# EAGLE schematic MM2_plates (EAGLE 7.4.0)
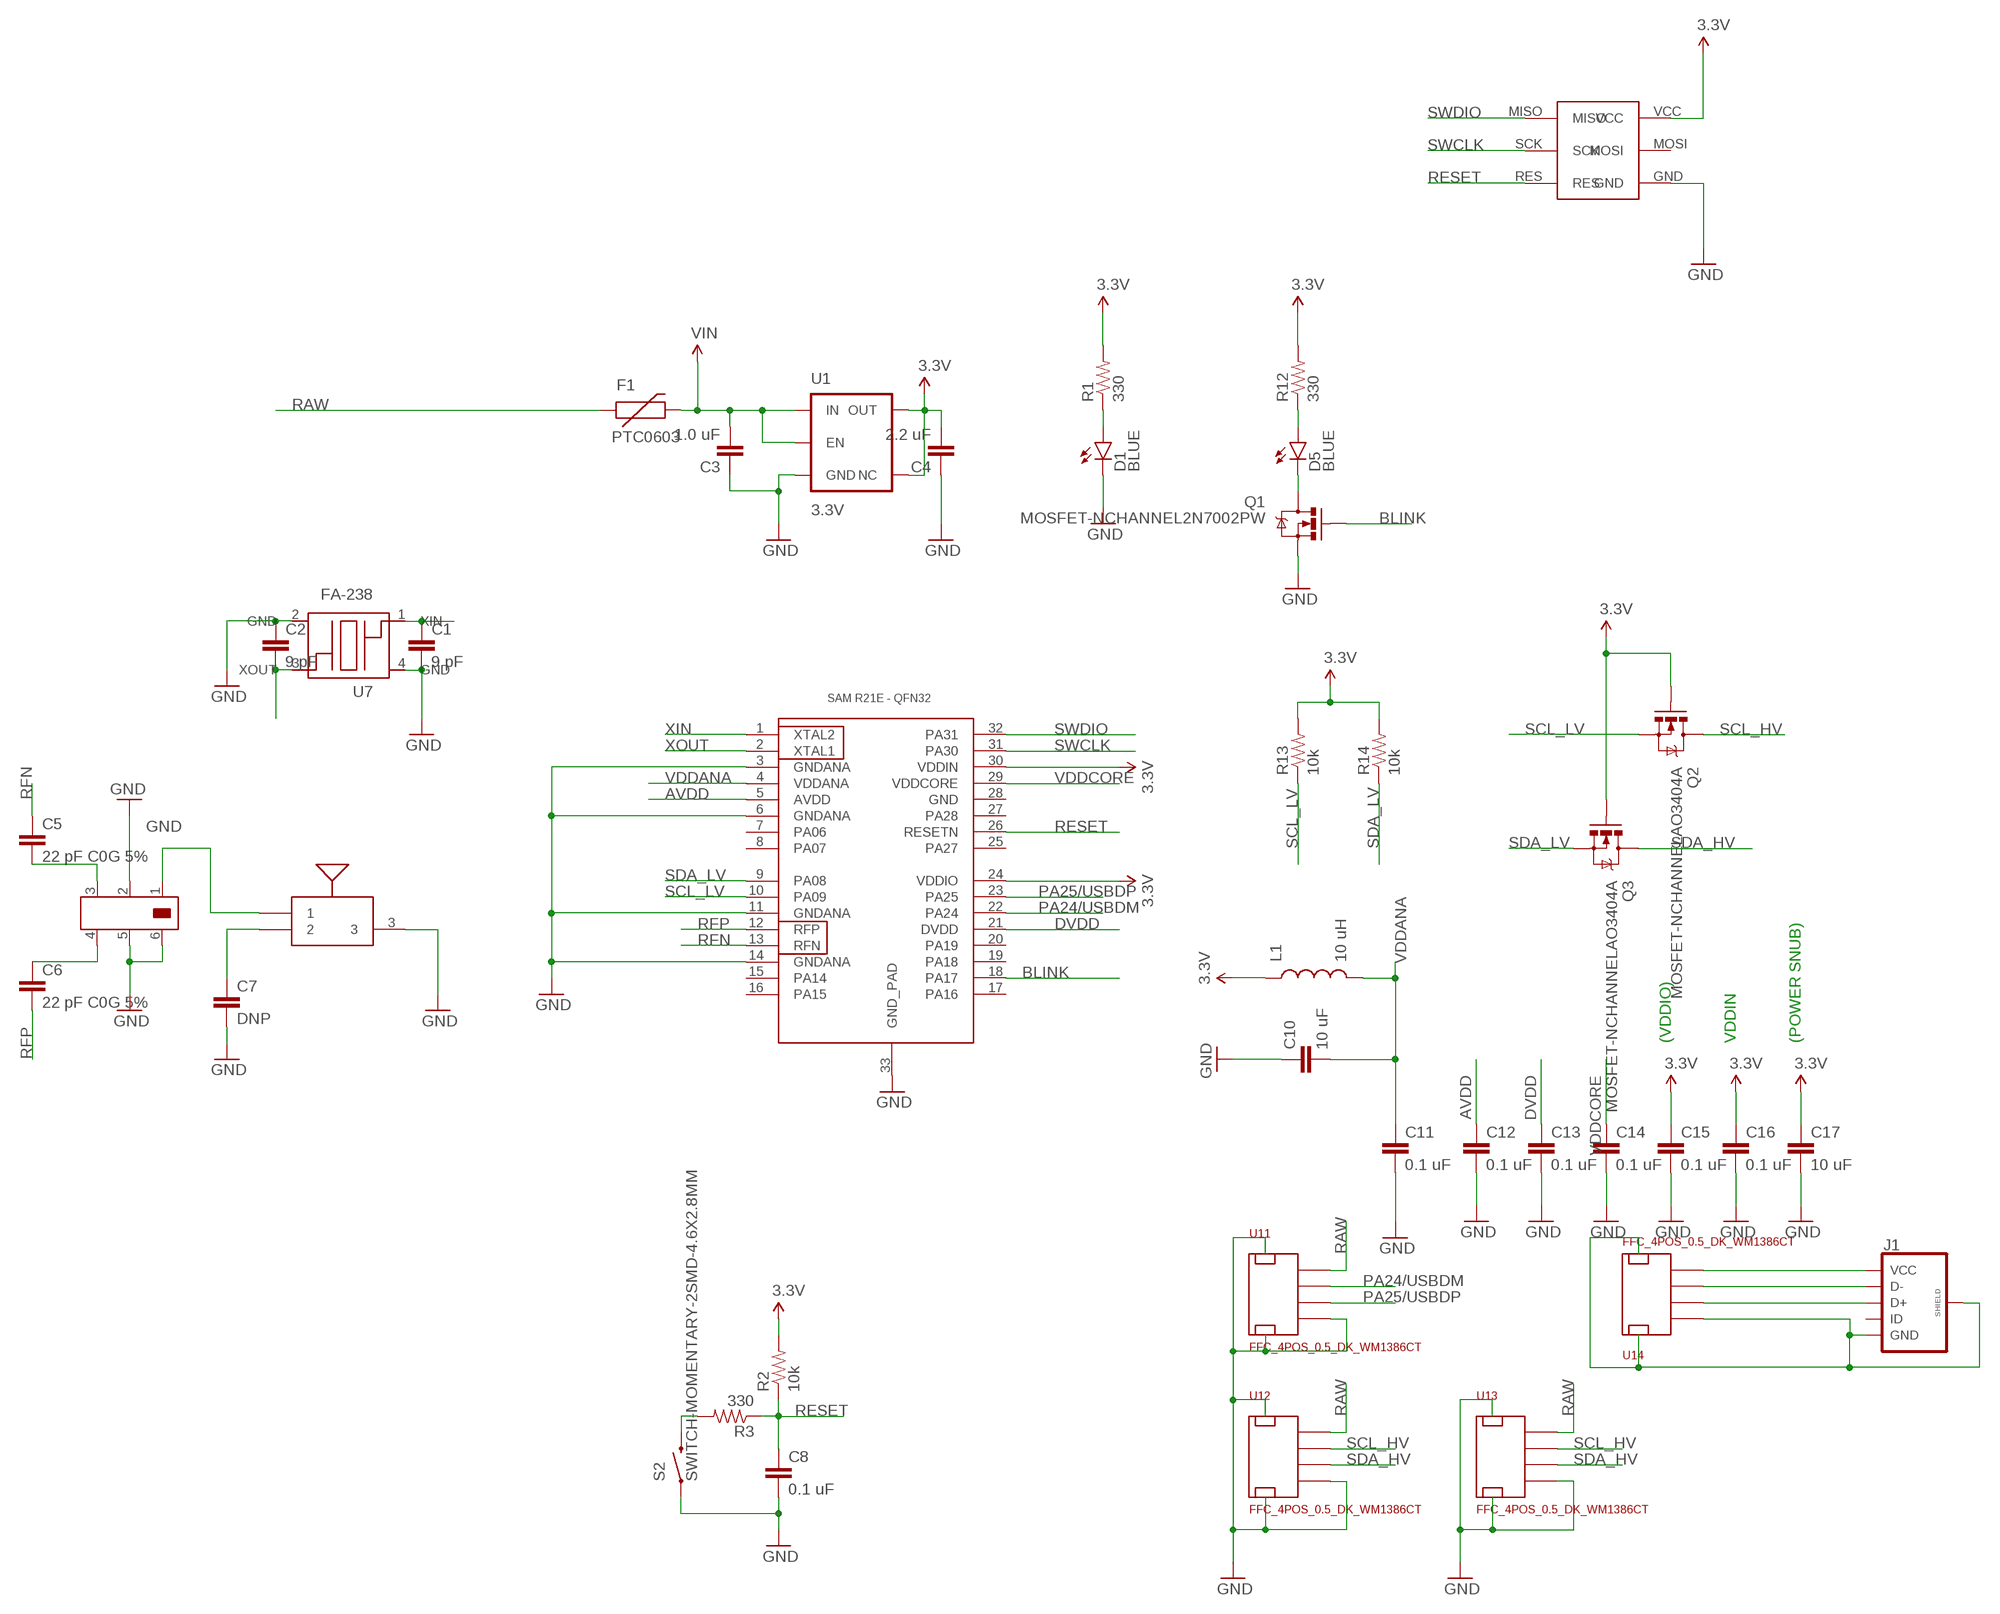
[diagram p0: schematic, sheet 1, part 1 of 2]
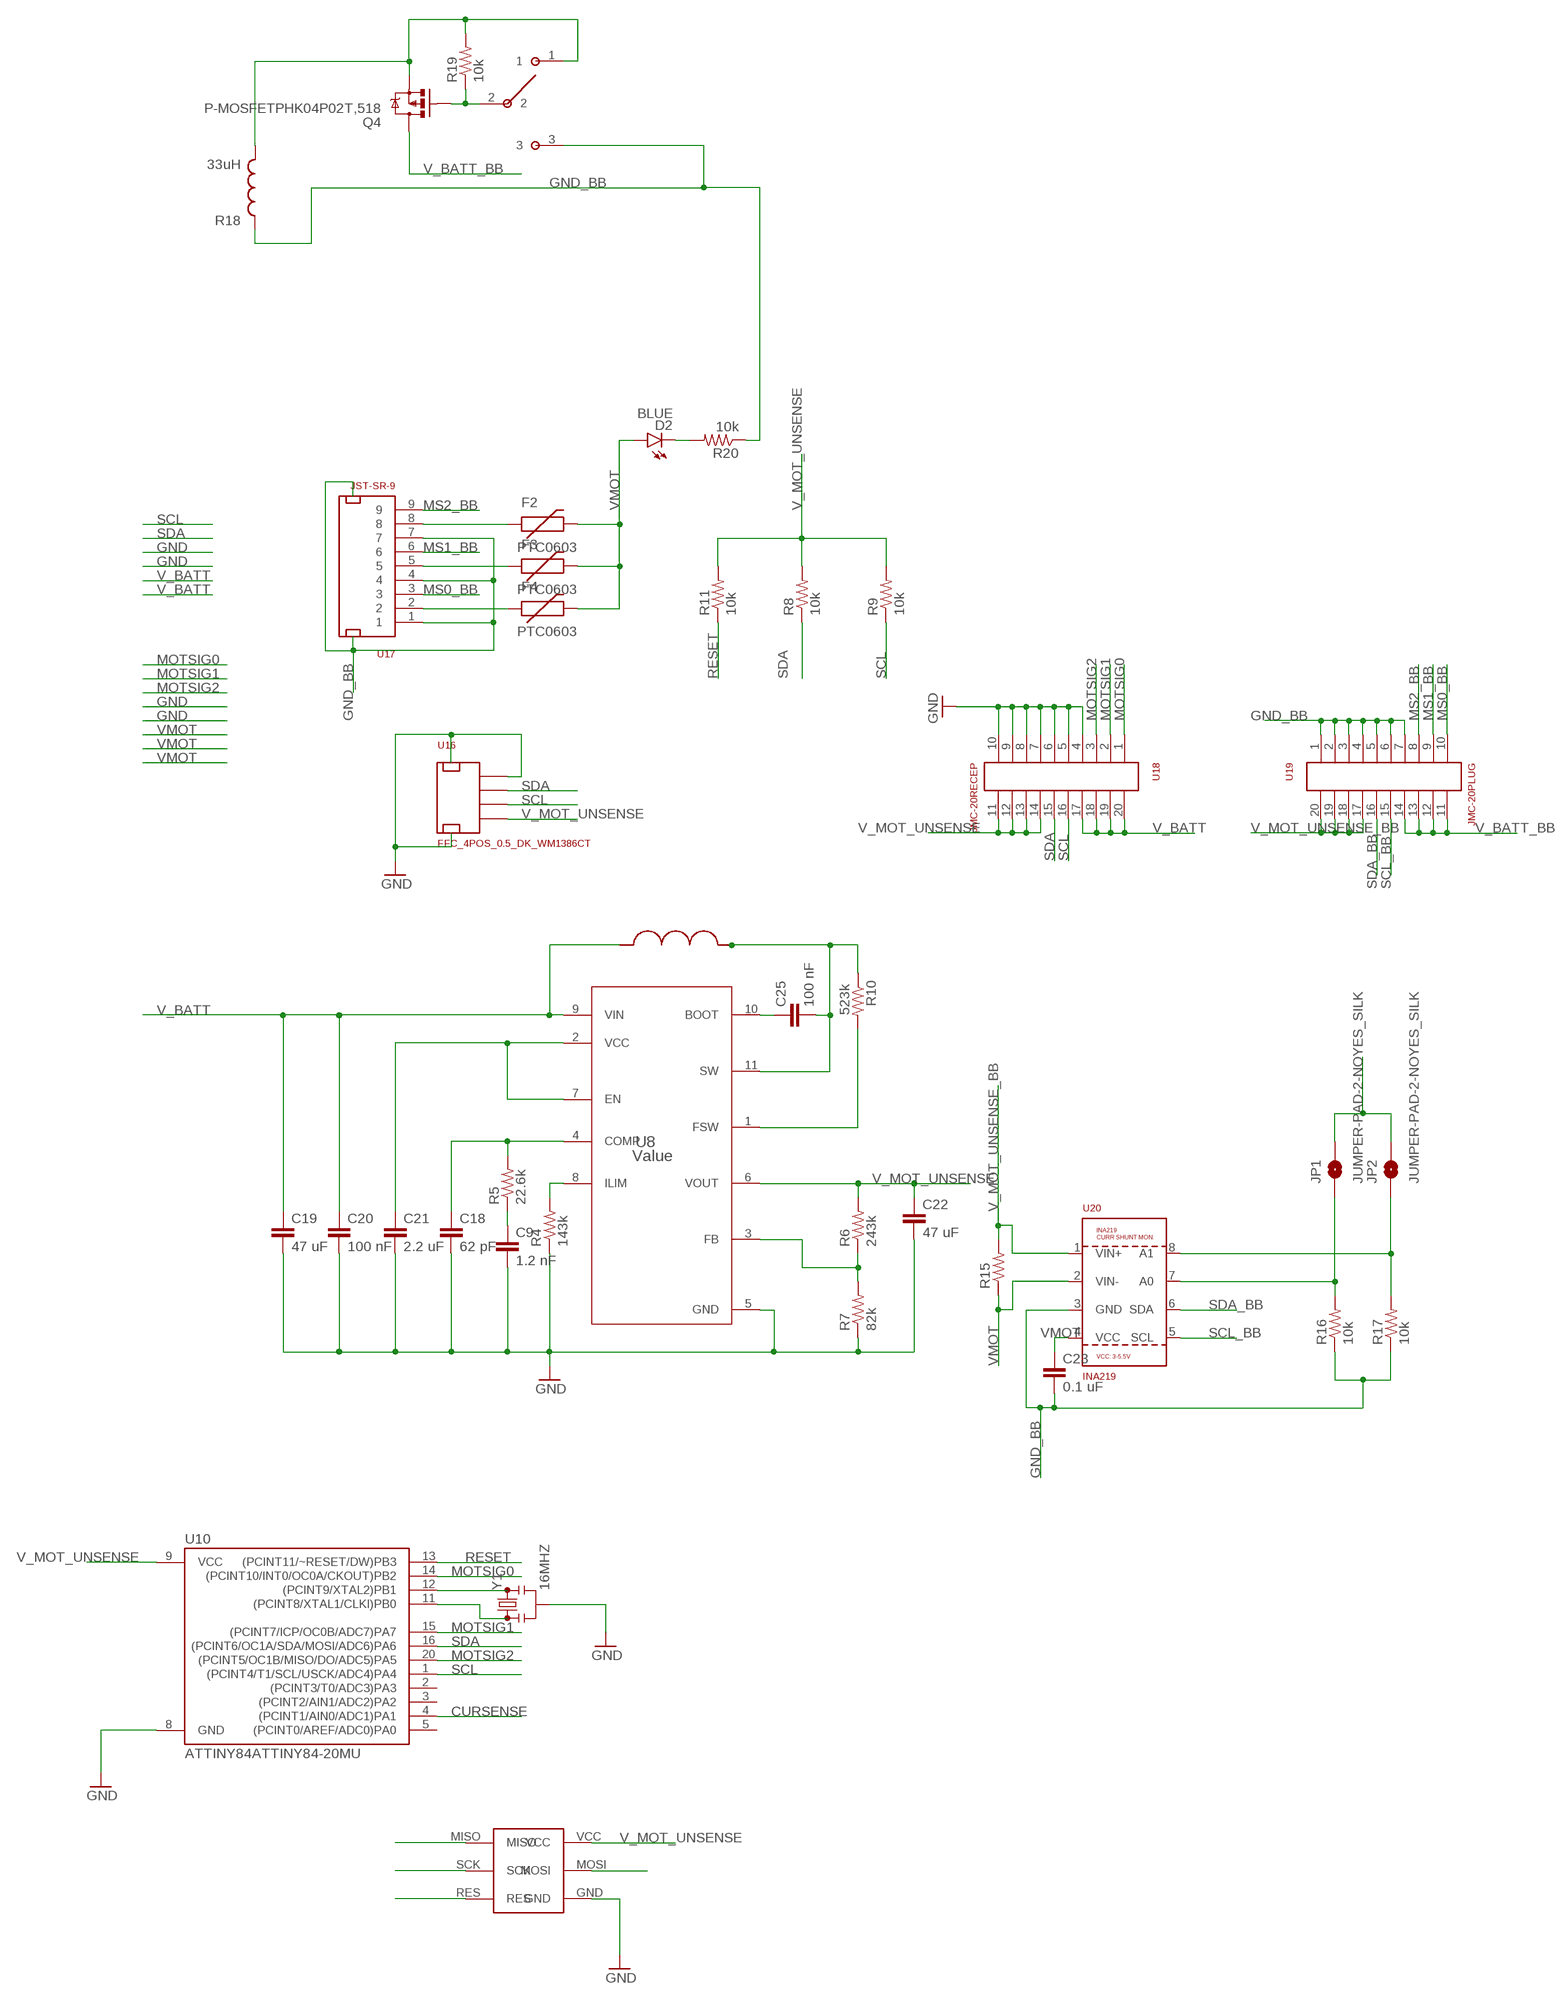
[diagram p1: schematic, sheet 1, part 2 of 2]

## Parts
C1  9 pF  CAP0402-CAP  [0402-CAP]
C2  9 pF  CAP0402-CAP  [0402-CAP]
C3  1.0 uF  CAP0402-CAP  [0402-CAP]
C4  2.2 uF  CAP0402-CAP  [0402-CAP]
C5  22 pF C0G 5%  CAP0402-CAP  [0402-CAP]
C6  22 pF C0G 5%  CAP0402-CAP  [0402-CAP]
C7  DNP  CAP0402-CAP  [0402-CAP]
C8  0.1 uF  CAP0402-CAP  [0402-CAP]
C9  1.2 nF  CAP0805  [0805]
C10  10 uF  CAP0402-CAP  [0402-CAP]
C11  0.1 uF  CAP0402-CAP  [0402-CAP]
C12  0.1 uF  CAP0402-CAP  [0402-CAP]
C13  0.1 uF  CAP0402-CAP  [0402-CAP]
C14  0.1 uF  CAP0402-CAP  [0402-CAP]
C15  0.1 uF  CAP0402-CAP  [0402-CAP]
C16  0.1 uF  CAP0402-CAP  [0402-CAP]
C17  10 uF  CAP0402-CAP  [0402-CAP]
C18  62 pF  CAP0805  [0805]
C19  47 uF  CAP1206  [1206]
C20  100 nF  CAP0402-CAP  [0402-CAP]
C21  2.2 uF  CAP0603-CAP  [0603-CAP]
C22  47 uF  CAP1206  [1206]
C23  0.1 uF  CAP0402-CAP  [0402-CAP]
C25  100 nF  CAP0402-CAP  [0402-CAP]
D1  BLUE  LED-BLUE0603  [LED-0603]
D2  BLUE  LED-BLUE0603  [LED-0603]
D5  BLUE  LED-BLUE0603  [LED-0603]
F1  PTC0603  [0603]
F2  PTC0603  [0603]
F3  PTC0603  [0603]
F4  PTC0603  [0603]
J1  USB_MICROB_PLUGCONN-11752  [USB-B-MICRO-SMD_V03]
JP1  JUMPER-PAD-2-NOYES_SILK  [PAD-JUMPER-2-NO_YES_SILK]
JP2  JUMPER-PAD-2-NOYES_SILK  [PAD-JUMPER-2-NO_YES_SILK]
L1  10 uH  INDUCTOR0603  [0603]
L2  WE_IND_4.1MM732-8229-1-ND  [WE_4MM_IND]
Q1  MOSFET-NCHANNEL2N7002PW  [SOT323]
Q2  MOSFET-NCHANNELAO3404A  [SOT23-3]
Q3  MOSFET-NCHANNELAO3404A  [SOT23-3]
Q4  P-MOSFETPHK04P02T,518  [SO08]
R1  330  RESISTOR0402-RES  [0402-RES]
R2  10k  RESISTOR0402-RES  [0402-RES]
R3  330  RESISTOR0402-RES  [0402-RES]
R4  143k  RESISTOR1206  [1206]
R5  22.6k  RESISTOR0402-RES  [0402-RES]
R6  243k  RESISTOR0402-RES  [0402-RES]
R7  82k  RESISTOR0603-RES  [0603-RES]
R8  10k  RESISTOR0402-RES  [0402-RES]
R9  10k  RESISTOR0402-RES  [0402-RES]
R10  523k  RESISTOR1206  [1206]
R11  10k  RESISTOR0402-RES  [0402-RES]
R12  330  RESISTOR0402-RES  [0402-RES]
R13  10k  RESISTOR0402-RES  [0402-RES]
R14  10k  RESISTOR0402-RES  [0402-RES]
R15  RESISTOR0402-RES  [0402-RES]
R16  10k  RESISTOR0402-RES  [0402-RES]
R17  10k  RESISTOR0402-RES  [0402-RES]
R18  33uH  INDUCTOR1206H*  [INDUCTOR-1206]
R19  10k  RESISTOR0402-RES  [0402-RES]
R20  10k  RESISTOR0402-RES  [0402-RES]
S1  AYZ0102AGRLC  [AYZ0102AGRLC]
S2  SWITCH-MOMENTARY-2SMD-4.6X2.8MM  [TACTILE_SWITCH_SMD_4.6X2.8MM]
U1  3.3V  V_REG_AP2112K-3.3V  [SOT23-5]
U2  ATSAMR21E18A-MUT  [QFN32]
U5  PULSE_ANT_2.4GHZ  [ANT_BAR]
U6  JOHANSON_2450BM15A0015E  [0805_BALUN]
U7  FA-238  [FA-238]
U8  Value  TPS61089RNRR  [RNR0011A]
U9  TC2030_ISP  [TAG_CONNECT_6PIN_NOSIDEHOLES]
U10  ATTINY84ATTINY84-20MU  [QFN20]
U11  FFC_4POS_0.5_DK_WM1386CT  [503480]
U12  FFC_4POS_0.5_DK_WM1386CT  [503480]
U13  FFC_4POS_0.5_DK_WM1386CT  [503480]
U14  FFC_4POS_0.5_DK_WM1386CT  [503480]
U16  FFC_4POS_0.5_DK_WM1386CT  [503480]
U17  JST-SR-9  [JST-SR-9]
U18  JMC-20RECEP  [JST_RECEP_JMC0.5_20]
U19  JMC-20PLUG  [JST_PLUG_JMC0.5_20]
U20  INA219  [SOT-23-8]
U21  TC2030_ISP  [TAG_CONNECT_6PIN_NOSIDEHOLES]
Y1  16MHZ  RESONATOR16MHZ  [RESONATOR-SMD]

## Nets
3.3V: C4.2 C15.1 C16.1 C17.1 L1.1 Q2.1(G) Q3.1(G) R1.2 R2.2 R12.2 R13.2 R14.2 U1.4(NC) U1.5(OUT) U2.24(VDDIO) U2.30(VDDIN) U9.VCC
AVDD: C12.1 U2.5(AVDD)
BLINK: Q1.1(G) U2.18(PA17)
CURSENSE: U10.4((PCINT1/AIN0/ADC1)PA1)
DVDD: C13.1 U2.21(DVDD)
GND: C1.2 C2.1 C3.1 C4.1 C7.2 C8.2 C9.2 C10.1 C11.2 C12.2 C13.2 C14.2 C15.2 C16.2 C17.2 C18.2 C19.2 C20.2 C21.2 C22.2 D1.C Q1.2(S) R4.1 R7.1 S2.1 S2.2 U1.2(GND) U2.3(GNDANA) U2.6(GNDANA) U2.11(GNDANA) U2.14(GNDANA) U2.33(GND_PAD) U5.3 U6.2 U6.5 U6.6 U7.2(GND) U7.4(GND) U8.5(GND) U9.GND U10.8(GND) U11.P$4 U11.P$5 U11.P$6 U12.P$4 U12.P$5 U12.P$6 U13.P$4 U13.P$5 U13.P$6 U16.P$1 U16.P$5 U16.P$6 U18.4 U18.5 U18.6 U18.7 U18.8 U18.9 U18.10 U21.GND Y1.2
GND_BB: C23.2 R16.1 R17.1 R18.P$1 R20.1 S1.3 U17.1 U17.4 U17.7 U17.P$10 U17.P$11 U19.1 U19.2 U19.3 U19.4 U19.5 U19.6 U19.7 U20.3(GND)
MOTSIG0: U10.14((PCINT10/INT0/OC0A/CKOUT)PB2) U18.1
MOTSIG1: U10.15((PCINT7/ICP/OC0B/ADC7)PA7) U18.2
MOTSIG2: U10.20((PCINT5/OC1B/MISO/DO/ADC5)PA5) U18.3 U21.MISO
MS0_BB: U17.3 U19.10
MS1_BB: U17.6 U19.9
MS2_BB: U17.9 U19.8
N$1: F2.1 U17.8
N$2: R3.2 S2.3 S2.4
N$3: R4.2 U8.8(ILIM)
N$4: U10.12((PCINT9/XTAL2)PB1) Y1.3
N$5: U10.11((PCINT8/XTAL1/CLKI)PB0) Y1.1
N$6: U5.1 U6.1
N$7: C7.1 U5.2
N$8: D1.A R1.1
N$10: C5.2 U6.3
N$11: C6.1 U6.4
N$13: Q4.4(G) R19.1 S1.2
N$14: C9.1 R5.1
N$15: C18.1 R5.2 U8.4(COMP)
N$16: JP1.1 R16.2 U20.7(A0)
N$17: F3.1 U17.5
N$18: JP2.1 R17.2 U20.8(A1)
N$19: C21.1 U8.2(VCC) U8.7(EN)
N$20: D5.A R12.1
N$21: D5.C Q1.3(D)
N$22: Q4.1(S) Q4.2(S) Q4.3(S) R18.P$2 R19.2 S1.1
N$23: F4.1 U17.2
N$24: J1.VBUS(VCC) U14.P$4
N$25: J1.D- U14.P$3
N$26: J1.D+ U14.P$2
N$27: C25.1 U8.10(BOOT)
N$28: C25.2 L2.P$2 R10.1 U8.11(SW)
N$29: R10.2 U8.1(FSW)
N$30: J1.GND J1.SHIELD1(SHIELD) J1.SHIELD2(SHIELD) J1.SHIELD3(SHIELD) U14.P$1 U14.P$5 U14.P$6
N$31: R6.1 R7.2 U8.3(FB)
N$33: D2.C R20.2
PA24/USBDM: U2.22(PA24) U11.P$2
PA25/USBDP: U2.23(PA25) U11.P$3
RAW: F1.1 U11.P$1 U12.P$1 U13.P$1
RESET: C8.1 R2.1 R3.1 R11.1 U2.26(RESETN) U9.RES U10.13((PCINT11/~RESET/DW)PB3) U21.RES
RFN: C5.1 U2.13(RFN)
RFP: C6.2 U2.12(RFP)
SCL: R9.1 U10.1((PCINT4/T1/SCL/USCK/ADC4)PA4) U16.P$3 U18.16 U21.SCK
SCL_BB: U19.15 U20.5(SCL)
SCL_HV: Q2.3(D) U12.P$2 U13.P$2
SCL_LV: Q2.2(S) R13.1 U2.10(PA09)
SDA: R8.1 U10.16((PCINT6/OC1A/SDA/MOSI/ADC6)PA6) U16.P$2 U18.15 U21.MOSI
SDA_BB: U19.16 U20.6(SDA)
SDA_HV: Q3.3(D) U12.P$3 U13.P$3
SDA_LV: Q3.2(S) R14.1 U2.9(PA08)
SWCLK: U2.31(PA30) U9.SCK
SWDIO: U2.32(PA31) U9.MISO
V_BATT: C19.1 C20.1 L2.P$1 U8.9(VIN) U18.17 U18.18 U18.19 U18.20
V_BATT_BB: Q4.5(D) Q4.6(D) Q4.7(D) Q4.8(D) U19.11 U19.12 U19.13 U19.14
V_MOT_UNSENSE: C22.1 R6.2 R8.2 R9.2 R11.2 U8.6(VOUT) U10.9(VCC) U16.P$4 U18.11 U18.12 U18.13 U18.14 U21.VCC
V_MOT_UNSENSE_BB: R15.2 U19.17 U19.18 U19.19 U19.20 U20.1(VIN+)
VDDANA: C10.2 C11.1 L1.2 U2.4(VDDANA)
VDDCORE: C14.1 U2.29(VDDCORE)
VIN: C3.2 F1.2 U1.1(IN) U1.3(EN)
VMOT: C23.1 D2.A F2.2 F3.2 F4.2 JP1.2 JP2.2 R15.1 U20.2(VIN-) U20.4(VCC)
XIN: C1.1 U2.1(XTAL2) U7.1(XIN)
XOUT: C2.2 U2.2(XTAL1) U7.3(XOUT)
Unconnected: J1.ID U2.7(PA06) U2.8(PA07) U2.15(PA14) U2.16(PA15) U2.17(PA16) U2.19(PA18) U2.20(PA19) U2.25(PA27) U2.27(PA28) U2.28(GND) U9.MOSI U10.2((PCINT3/T0/ADC3)PA3) U10.3((PCINT2/AIN1/ADC2)PA2) U10.5((PCINT0/AREF/ADC0)PA0)

## Notes on the sheet
- (VDDIO) | VDDIN | (POWER SNUB)

## Library data of the parts
C1-C23 C25 = SparkFun-Passives:CAP: Capacitor Standard 0603 ceramic capacitor, and 0.1" leaded capacitor.
D1 D2 D5 = SparkFun-LED:LED-BLUE: Blue LEDs for production use Various blue LEDs stocked by SparkFun production 0603 - DIO-08575 Rebel - DIO-09553 1206 - DIO-09911; PROD_ID: DIO-08575
F1-F4 = SparkFun-PowerIC:PTC: Resettable Fuse PTC Resettable Fuse. Spark Fun Electronics SKU : COM-08357
J1 = SparkFun-Connectors:USB_MICROB_PLUG: USB Micro-B connectors Some male, some female. Watch your step!; PROD_ID: CONN-11752
JP1 JP2 = SparkFun-Passives:JUMPER-PAD-2-NO
L1 R18 = SparkFun-Passives:INDUCTOR: Inductors Basic Inductor/Choke - 0603 and 1206. Footprints are not proven and vary greatly between part numbers. INDUCTOR POWER 3.3UH 4.0A SMD 0.197" L x 0.197" W x 0.177" H (5.00mm x 5.00mm x 4.50mm)
L2 = CSL_Components:WE_IND_4.1MM
Q1 = SparkFun-DiscreteSemi:MOSFET-NCHANNEL: Common NMOSFET Parts MFG P/N Store ID Prod ID FDD8780 TRANS-09984 SI7820DN TRANS-11055 FDS6630A IC-08089 2N7002PW TRANS-11151 FQP30N06L COM-10213 TRANS-10060 BSS123LT1G TRANS-08345 BSS138 TRANS-00830 BS170 2N7000; PROD_ID: TRANS-11151
Q2 Q3 = SparkFun-DiscreteSemi:MOSFET-NCHANNEL: Common NMOSFET Parts MFG P/N Store ID Prod ID FDD8780 TRANS-09984 SI7820DN TRANS-11055 FDS6630A IC-08089 2N7002PW TRANS-11151 FQP30N06L COM-10213 TRANS-10060 BSS123LT1G TRANS-08345 BSS138 TRANS-00830 BS170 2N7000; PROD_ID: TRAN-12988
Q4 = CSL_Components:P-MOSFET
R1-R3 R5-R9 R11-R17 R19 R20 = SparkFun-Passives:RESISTOR: Resistor Basic schematic elements and footprints for 0603, 1206, and PTH resistors.
R4 R10 = SparkFun-Resistors:RESISTOR: Resistor Basic schematic elements and footprints for 0603, 1206, and PTH resistors.
S1 = CSL_Components:AYZ0102AGRLC
S2 = SparkFun-Electromechanical:SWITCH-MOMENTARY-2: Various NO switches- pushbuttons, reed, etc; PROD_ID: SWCH-13065
U1 = SparkFun-PowerIC:V_REG_AP2112: AP2112 - 600mA CMOS LDO Regulator w/ Enable The AP2112 is CMOS process low dropout linear regulator with enable function, the regulator delivers a guaranteed 600mA (min.) continuous load current. Features Output Voltage Accuracy: ±1.5% Output Current: 600mA (Min.) Foldback Short Current Protection: 50mA Enable Function to Turn ON/OFF VOUT Low Dropout Voltage (3.3V): 250mV (Typ.) @IOUT=600mA Excellent Load Regulation: 0.2%/A (Typ.) Excellent Line Regulation: 0.02%/V (Typ.) Low Quiescent Current: 55μA (Typ.) Low Standby Current: 0.01μA (Typ.) Low Output Noise: 50μVRMS PSRR: 100Hz -65dB, 1kHz -65dB OTSD Protection Stable with 1.0μF Flexible Cap: Ceramic, Tantalum and Aluminum Electrolytic Operation Temperature Range: -40°C to 85°C ESD: MM 400V, HBM 4000V; PROD_ID: VREG-12457
U2 = atmel-samr21:ATSAMR21E18A-MUT: This is the ATMEL SAMR21E QFN-32. ATSAMR21E18A
U5 = bar_antenna:PULSE_ANT_2.4GHZ: Manufacturer part #W3008
U6 = balun:JOHANSON_2450BM15A0015E
U7 = crystals:FA-238
U8 = TPS61089RNRR_4.8V:TPS61089RNRR; MANUFACTURER: Texas Instruments; MANUFACTURER_NAME: Texas Instruments; MANUFACTURER_PART_NUMBER: TPS61089RNRR; PARTNUMBER: TPS61089RNRR; REFDES: RefDes; TYPE: TYPE
U9 U21 = CSL_Components:TC2030_ISP
U10 = SparkFun-DigitalIC:ATTINY84: Atmel 14-pin 2/4/8kB flash uC
U11-U14 U16 = CSL_Components:FFC_4POS_0.5_DK_WM1386CT
U17 = CSL_Components:JST-SR-9
U18 U19 = CSL_Components:JMC-20
U20 = CSL_Components:INA219
Y1 = SparkFun-FreqCtrl:RESONATOR: Resonator Small SMD resonator. Used, eg, on the Arduino Pro/ Pro Mini boards. 8MHz- XTAL-08895 16MHz- XTAL-08900; PROD_ID: XTAL-08900